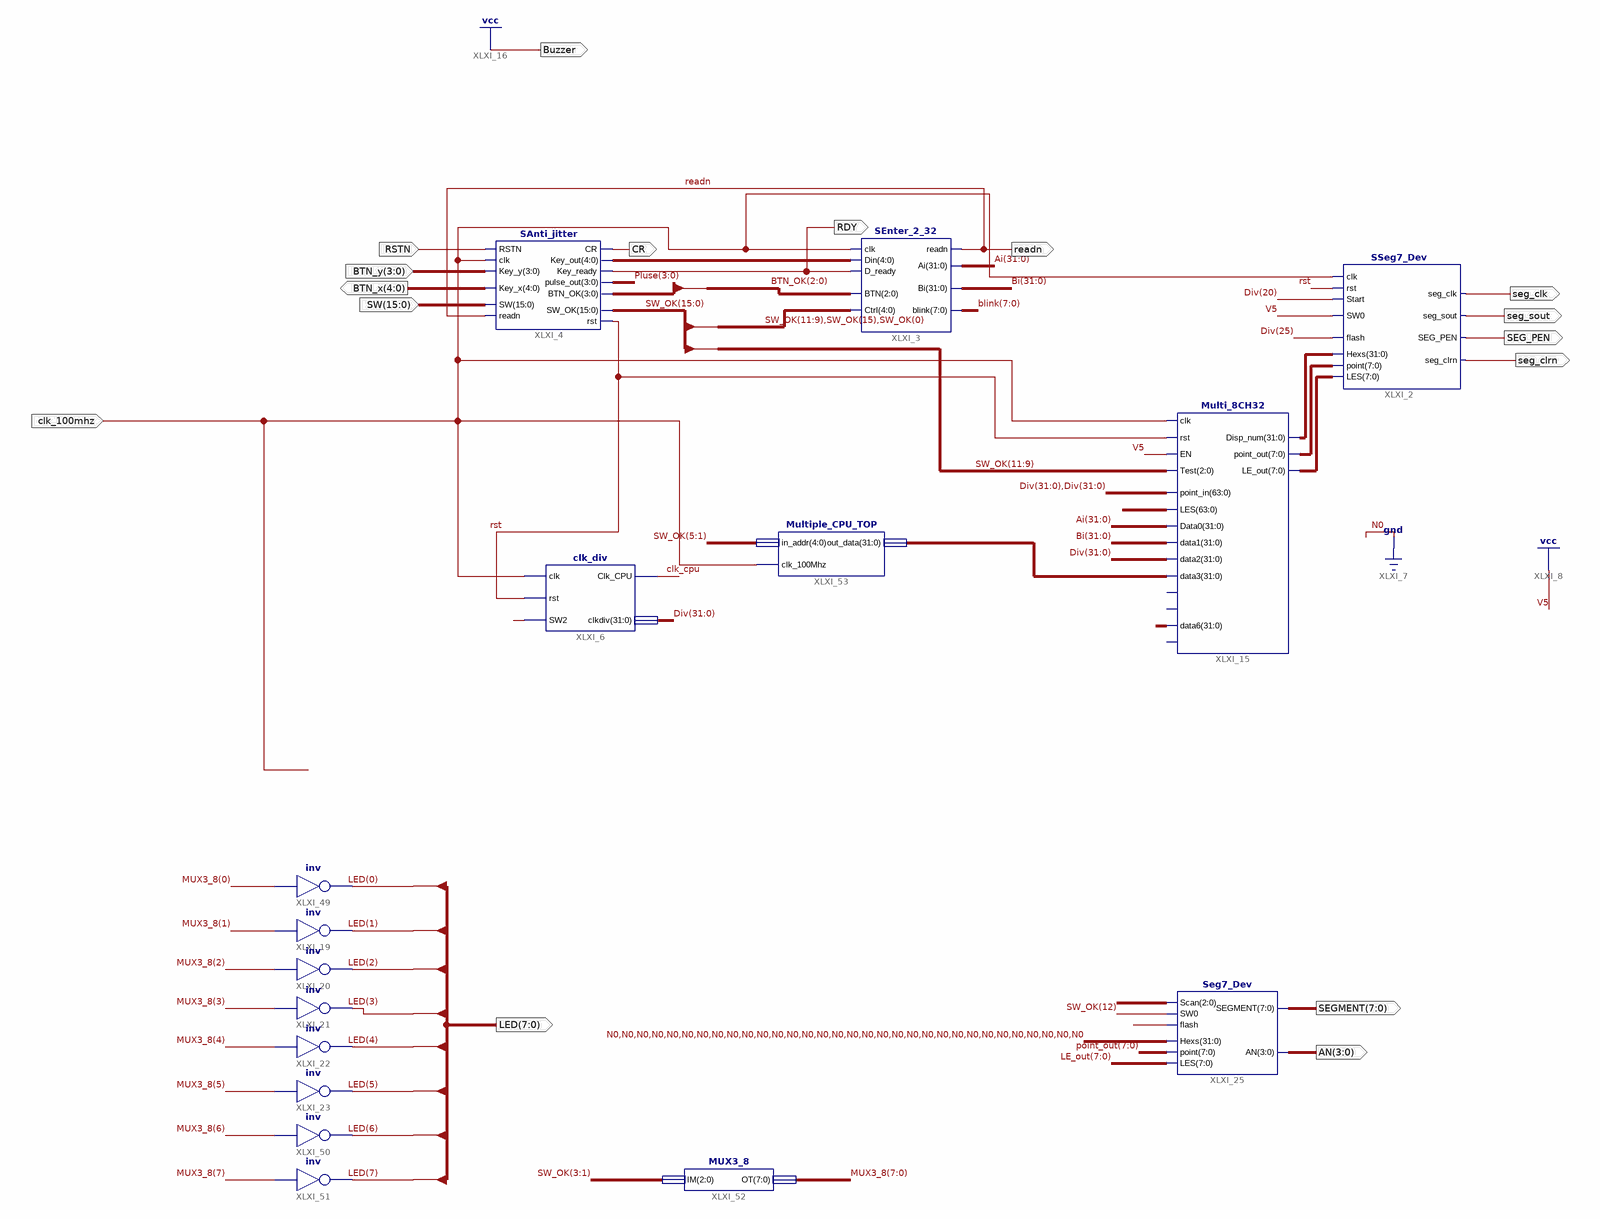
[diagram p0: schematic sheet 1]
// Xilinx ISE schematic ALU.sch (kintex7) as structural Verilog: 16 symbols, 16 ports
module ALU (
  input  RSTN,
  input  clk_100mhz,
  input  [3:0] BTN_y,
  input  [15:0] SW,
  output readn,
  output [4:0] BTN_x,
  output seg_clk,
  output seg_sout,
  output seg_clrn,
  output SEG_PEN,
  output CR,
  output RDY,
  output Buzzer,
  output [7:0] SEGMENT,
  output [3:0] AN,
  output [7:0] LED
);

  wire clk_cpu, rst;
  wire [3:0] BTN_OK, Pluse;
  wire [4:0] XLXN_60;
  wire [7:0] blink, LE_out, MUX3_8, point_out, XLXN_117, XLXN_118;
  wire [15:0] SW_OK;
  wire [31:0] Ai, Bi, Div, XLXN_114, XLXN_120, XLXN_122;

  SEnter_2_32 XLXI_3 (
    .readn(readn), .Ai(Ai), .Bi(Bi), .blink(blink), .Din(XLXN_60), .D_ready(RDY), .clk(clk_100mhz),
    .Ctrl({SW_OK[11:9], SW_OK[15], SW_OK[0]}), .BTN(BTN_OK[2:0]));
  SSeg7_Dev XLXI_2 (
    .LES(XLXN_117), .SEG_PEN(SEG_PEN), .seg_sout(seg_sout), .seg_clrn(seg_clrn), .point(XLXN_118),
    .Hexs(XLXN_120), .SW0(1'b1), .flash(Div[25]), .seg_clk(seg_clk), .clk(clk_100mhz), .rst(rst),
    .Start(Div[20]));
  SAnti_jitter XLXI_4 (
    .SW(SW), .readn(readn), .Key_y(BTN_y), .Key_x(BTN_x), .RSTN(RSTN), .clk(clk_100mhz), .Key_out(XLXN_60),
    .Key_ready(RDY), .CR(CR), .rst(rst), .SW_OK(SW_OK), .pulse_out(Pluse), .BTN_OK(BTN_OK));
  clk_div XLXI_6 (.clk(clk_100mhz), .rst(rst), .SW2(SW_OK[3]), .Clk_CPU(clk_cpu), .clkdiv(Div));
  Multi_8CH32 XLXI_15 (
    .Test(SW_OK[11:9]), .point_in({Div, Div}), .EN(1'b1), .clk(clk_100mhz), .rst(rst),
    .LES({{12{1'b0}}, blink[3:0], {32{1'b0}}, blink, blink}), .Data0(Ai), .data1(Bi), .data2(Div),
    .data3(XLXN_122), .data6(XLXN_114), .point_out(XLXN_118), .LE_out(XLXN_117), .Disp_num(XLXN_120));  // open: data4, data5, data7
  Seg7_Dev XLXI_25 (
    .LES(LE_out), .Scan({SW_OK[1], Div[19:18]}), .SEGMENT(SEGMENT), .AN(AN), .point(point_out),
    .flash(Div[25]), .SW0(SW_OK[12]), .Hexs({32{1'b0}}));
  not XLXI_49 (LED[0], MUX3_8[0]);
  not XLXI_50 (LED[6], MUX3_8[6]);
  not XLXI_51 (LED[7], MUX3_8[7]);
  not XLXI_19 (LED[1], MUX3_8[1]);
  not XLXI_20 (LED[2], MUX3_8[2]);
  not XLXI_21 (LED[3], MUX3_8[3]);
  not XLXI_22 (LED[4], MUX3_8[4]);
  not XLXI_23 (LED[5], MUX3_8[5]);
  MUX3_8 XLXI_52 (.IM(SW_OK[3:1]), .OT(MUX3_8));
  Multiple_CPU_TOP XLXI_53 (.in_addr(SW_OK[5:1]), .clk_100Mhz(clk_100mhz), .out_data(XLXN_122));

  assign Buzzer = 1'b1;
endmodule
